# EAGLE design bGeigie3 (EAGLE 6.5.0)
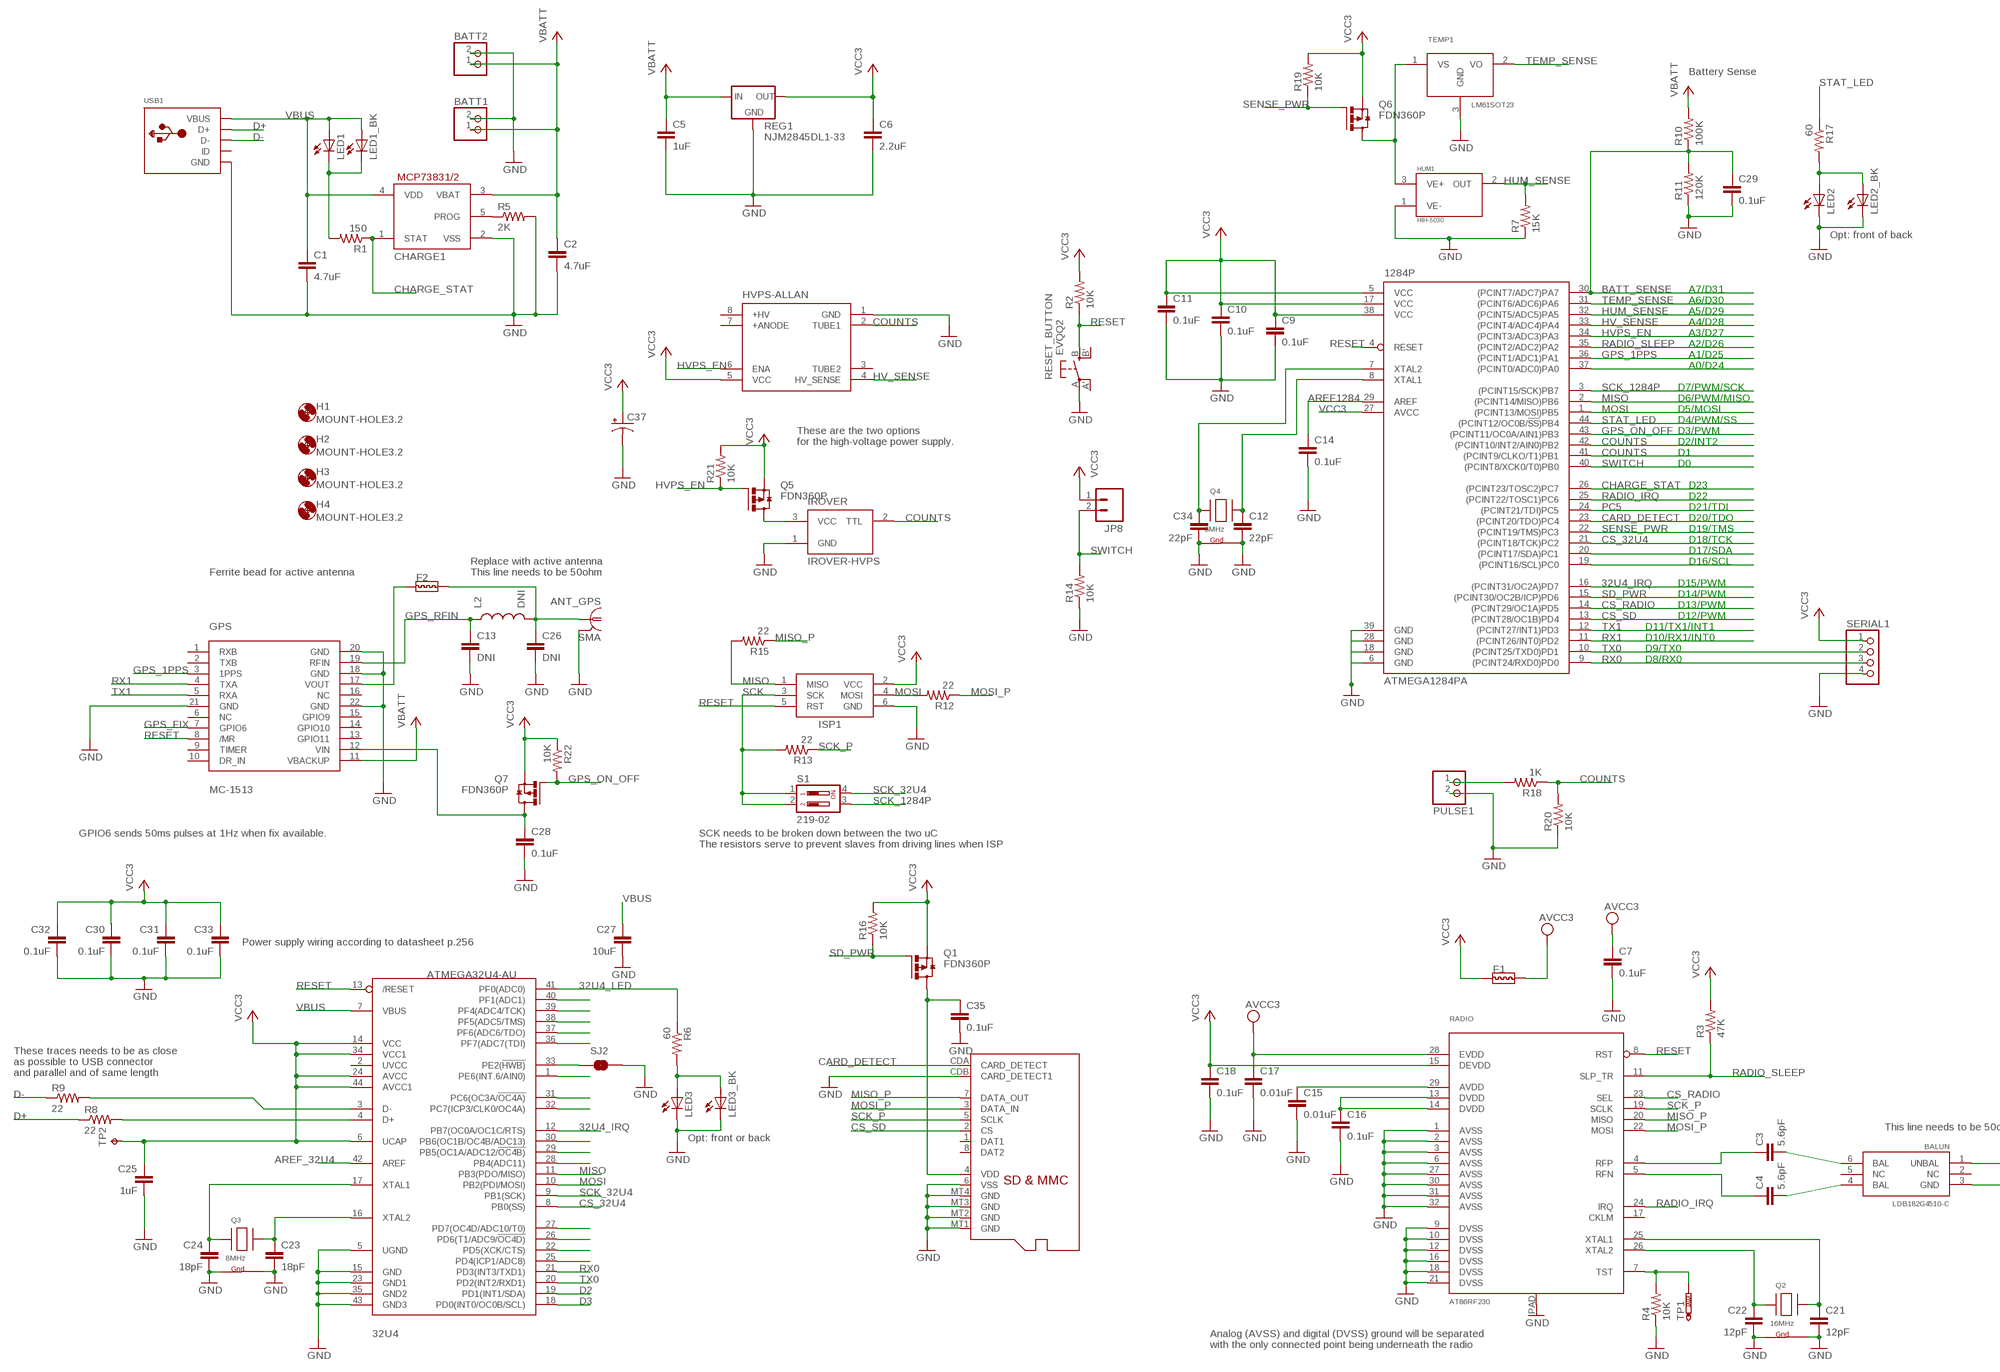
[diagram p0: schematic, sheet 1, part 1 of 2]
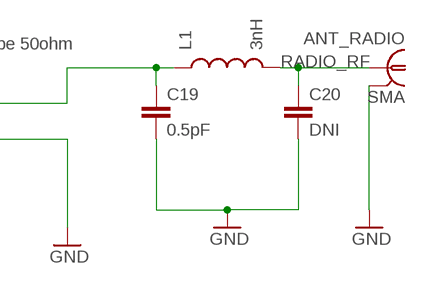
[diagram p1: schematic, sheet 1, part 2 of 2]

## Parts
32U4  ATMEGA32U4-AU  [TQFP44]
1284P  ATMEGA1284PA  [TQFP44]
ANT_GPS  SMA  LTI-SASF54GT  [LTI-SASF54GT]
ANT_RADIO  SMA  LTI-SASF54GT  [LTI-SASF54GT]
BALUN  LDB182G4510-C  [LDB182G4510-C]
BATT1  JST_2PIN-THM  [JST-PH-2-THM]
BATT2  JST_2PIN-THM  [JST-PH-2-THM]
C1  4.7uF  CAP0805  [0805]
C2  4.7uF  CAP0805  [0805]
C3  5.6pF  CAP0402-CAP  [0402-CAP]
C4  5.6pF  CAP0402-CAP  [0402-CAP]
C5  1uF  CAP0805  [0805]
C6  2.2uF  CAP0805  [0805]
C7  0.1uF  CAP0603-CAP  [0603-CAP]
C9  0.1uF  CAP0603-CAP  [0603-CAP]
C10  0.1uF  CAP0603-CAP  [0603-CAP]
C11  0.1uF  CAP0603-CAP  [0603-CAP]
C12  22pF  CAP0603-CAP  [0603-CAP]
C13  DNI  CAP0402-CAP  [0402-CAP]
C14  0.1uF  CAP0603-CAP  [0603-CAP]
C15  0.01uF  CAP0603-CAP  [0603-CAP]
C16  0.1uF  CAP0603-CAP  [0603-CAP]
C17  0.01uF  CAP0603-CAP  [0603-CAP]
C18  0.1uF  CAP0603-CAP  [0603-CAP]
C19  0.5pF  CAP0402-CAP  [0402-CAP]
C20  DNI  CAP0402-CAP  [0402-CAP]
C21  12pF  CAP0603-CAP  [0603-CAP]
C22  12pF  CAP0603-CAP  [0603-CAP]
C23  18pF  CAP0603-CAP  [0603-CAP]
C24  18pF  CAP0603-CAP  [0603-CAP]
C25  1uF  CAP0603-CAP  [0603-CAP]
C26  DNI  CAP0402-CAP  [0402-CAP]
C27  10uF  CAP0805  [0805]
C28  0.1uF  CAP0603-CAP  [0603-CAP]
C29  0.1uF  CAP0603-CAP  [0603-CAP]
C30  0.1uF  CAP0603-CAP  [0603-CAP]
C31  0.1uF  CAP0603-CAP  [0603-CAP]
C32  0.1uF  CAP0603-CAP  [0603-CAP]
C33  0.1uF  CAP0603-CAP  [0603-CAP]
C34  22pF  CAP0603-CAP  [0603-CAP]
C35  0.1uF  CAP0603-CAP  [0603-CAP]
C37  CPOL-USD/7343-31W  [D/7343-31W]
CHARGE1  MCP73831/OT  [SOT23-5L]
F1  L-FERRITE-BEAD-0805  [0805]
F2  L-FERRITE-BEAD-0805  [0805]
GPS  MC-1513  [S4-1513]
H1  MOUNT-HOLE3.2  [3,2]
H2  MOUNT-HOLE3.2  [3,2]
H3  MOUNT-HOLE3.2  [3,2]
H4  MOUNT-HOLE3.2  [3,2]
HUM1  HIH-5030  [HIH-5030]
HVPS-ALLAN  HVPS-ALLANV2-REVERSE  [HVPS-ALLAN-V2-REVERSE]
IROVER  IROVER-HVPS  [IROVER]
ISP1  AVRISP-6  [AVRISP]
JP8  M023.5MM  [SCREWTERMINAL-3.5MM-2]
L1  3nH  INDUCTOR0402  [C0402]
L2  DNI  INDUCTOR0402  [C0402]
LED1  LEDCHIPLED_0603  [CHIPLED_0603]
LED1_BK  LEDCHIPLED_0603  [CHIPLED_0603]
LED2  LEDCHIPLED_0603  [CHIPLED_0603]
LED2_BK  LEDCHIPLED_0603  [CHIPLED_0603]
LED3  LEDCHIPLED_0603  [CHIPLED_0603]
LED3_BK  LEDCHIPLED_0603  [CHIPLED_0603]
PULSE1  JST_2PIN-THM  [JST-PH-2-THM]
Q1  FDN360P  [SUPER-SOT3]
Q2  16MHz  XTAL-4-3225  [NX3225]
Q3  8MHz  XTAL-4  [CRYSTAL-5032]
Q4  8MHz  XTAL-4  [CRYSTAL-5032]
Q5  FDN360P  [SUPER-SOT3]
Q6  FDN360P  [SUPER-SOT3]
Q7  FDN360P  [SUPER-SOT3]
R1  150  R-US_R0805  [R0805]
R2  10K  R-US_R0603  [R0603]
R3  47K  R-US_R0603  [R0603]
R4  10K  R-US_R0603  [R0603]
R5  2K  R-US_R0603  [R0603]
R6  60  R-US_R0805  [R0805]
R7  15K  R-US_R0603  [R0603]
R8  22  R-US_R0603  [R0603]
R9  22  R-US_R0603  [R0603]
R10  100K  R-US_R0603  [R0603]
R11  120K  R-US_R0603  [R0603]
R12  22  R-US_R0603  [R0603]
R13  22  R-US_R0603  [R0603]
R14  10K  R-US_R0603  [R0603]
R15  22  R-US_R0603  [R0603]
R16  10K  R-US_R0603  [R0603]
R17  60  R-US_R0805  [R0805]
R18  1K  R-US_R0603  [R0603]
R19  10K  R-US_R0603  [R0603]
R20  10K  R-US_R0603  [R0603]
R21  10K  R-US_R0603  [R0603]
R22  10K  R-US_R0603  [R0603]
RADIO  AT86RF230  [32QN1]
REG1  NJM2845DL1-33  LP2950CDT-3.3  [DPACK]
RESET_BUTTON  EVQQ2  [EVQ-Q2]
S1  219-02  [CTS-219-02]
SD  MICROSD  [DM3AT-SF-PEJM5]
SERIAL1  PINHD-1X4  [1X04]
SJ2  SOLDERJUMPERTRACE  [SJ_2S-TRACE]
TEMP1  LM61SOT23  [SOT23]
TP1  PTR1B1,27  [B1,27]
TP2  TPTP15SQ  [TP15SQ]
USB1  USBMINIB  [USB-MINIB]

## Nets
32U4_IRQ: 32U4.12(PB7(OC0A/OC1C/RTS)) 1284P.16((PCINT31/OC2A)PD7)
32U4_LED: 32U4.41(PF0(ADC0)) R6.1
32U4_PC7: 32U4.32(PC7(ICP3/CLK0/OC4A))
AREF1284: 1284P.29(AREF) C14.1
AREF_32U4: 32U4.42(AREF)
AVCC3: C7.1 C17.1 F1.2 RADIO.28(EVDD)
BATT_SENSE: 1284P.30((PCINT7/ADC7)PA7) C29.1 R10.1 R11.2
CARD_DETECT: 1284P.23((PCINT20/TDO)PC4) SD.CDA(CARD_DETECT)
CHARGE_STAT: 1284P.26((PCINT23/TOSC2)PC7) CHARGE1.1(STAT) R1.1
COUNTS: 1284P.41((PCINT9/CLKO/T1)PB1) 1284P.42((PCINT10/INT2/AIN0)PB2) HVPS-ALLAN.2(TUBE1) IROVER.2(TTL) R18.1 R20.2
CS_32U4: 32U4.8(PB0(SS)) 1284P.21((PCINT18/TCK)PC2)
CS_RADIO: 1284P.14((PCINT29/OC1A)PD5) RADIO.23(SEL)
CS_SD: 1284P.13((PCINT28/OC1B)PD4) SD.2(CS)
D2: 32U4.19(PD1(INT1/SDA))
D3: 32U4.18(PD0(INT0/OC0B/SCL))
D+: R8.1 USB1.D+
D-: R9.1 USB1.D-
GND: 32U4.5(UGND) 32U4.15(GND) 32U4.23(GND1) 32U4.35(GND2) 32U4.43(GND3) 1284P.6(GND) 1284P.18(GND) 1284P.28(GND) 1284P.39(GND) ANT_GPS.2(GND) ANT_RADIO.2(GND) BALUN.3(GND) BATT1.2 BATT2.2 C1.2 C2.2 C5.2 C6.2 C7.2 C9.2 C10.2 C11.2 C12.2 C13.2 C14.2 C15.2 C16.2 C17.2 C18.2 C19.2 C20.2 C21.2 C22.2 C23.2 C24.2 C25.2 C26.2 C27.2 C28.2 C29.2 C30.2 C31.2 C32.2 C33.2 C34.2 C35.2 C37.- CHARGE1.2(VSS) GPS.18(GND) GPS.20(GND) GPS.21(GND) GPS.22(GND) HUM1.1(VE-) HVPS-ALLAN.1(GND) IROVER.1(GND) ISP1.6(GND) LED2.C LED2_BK.C LED3.C LED3_BK.C PULSE1.2 Q2.2(G2) Q2.4(G1) Q3.2(G1) Q3.4(G2) Q4.2(G1) Q4.4(G2) R4.1 R5.2 R7.1 R11.1 R14.1 R20.1 RADIO.1(AVSS) RADIO.2(AVSS) RADIO.3(AVSS) RADIO.6(AVSS) RADIO.9(DVSS) RADIO.10(DVSS) RADIO.12(DVSS) RADIO.16(DVSS) RADIO.18(DVSS) RADIO.21(DVSS) RADIO.27(AVSS) RADIO.30(AVSS) RADIO.31(AVSS) RADIO.32(AVSS) RADIO.PAD REG1.4(GND) RESET_BUTTON.A(P) SD.6(VSS) SD.CDB(CARD_DETECT1) SD.MT1(GND) SD.MT2(GND) SD.MT3(GND) SD.MT4(GND) SERIAL1.4 SJ2.2 TEMP1.3(GND) USB1.GND
GPS_1PPS: 1284P.36((PCINT1/ADC1)PA1) GPS.3(1PPS)
GPS_FIX: GPS.7(GPIO6)
GPS_ON_OFF: 1284P.43((PCINT11/OC0A/AIN1)PB3) Q7.1(G) R22.2
GPS_RFIN: C13.1 GPS.19(RFIN) L2.1
HUM_SENSE: 1284P.32((PCINT5/ADC5)PA5) HUM1.2(OUT) R7.2
HV_SENSE: 1284P.33((PCINT4/ADC4)PA4) HVPS-ALLAN.4(HV_SENSE)
HVPS_EN: 1284P.34((PCINT3/ADC3)PA3) HVPS-ALLAN.6(ENA) Q5.1(G) R21.1
MISO: 32U4.11(PB3(PDO/MISO)) 1284P.2((PCINT14/MISO)PB6) ISP1.1(MISO) R15.2
MISO_P: R15.1 RADIO.20(MISO) SD.7(DATA_OUT)
MOSI: 32U4.10(PB2(PDI/MOSI)) 1284P.1((PCINT13/MOSI)PB5) ISP1.4(MOSI) R12.2
MOSI_P: R12.1 RADIO.22(MOSI) SD.3(DATA_IN)
N$1: 32U4.16(XTAL2) C23.1 Q3.3(X2)
N$2: LED1.C LED1_BK.C R1.2
N$3: PULSE1.1 R18.2
N$4: CHARGE1.5(PROG) R5.1
N$5: BALUN.4(BAL) C4.2
N$6: 1284P.8(XTAL1) C12.1 Q4.3(X2)
N$7: 1284P.7(XTAL2) C34.1 Q4.1(X1)
N$8: C16.1 RADIO.13(DVDD) RADIO.14(DVDD)
N$9: C15.1 RADIO.29(AVDD)
N$11: ANT_GPS.1 C26.1 F2.2 L2.2
N$12: C21.1 Q2.3(X2) RADIO.25(XTAL1)
N$13: C22.1 Q2.1(X1) RADIO.26(XTAL2)
N$14: F2.1 GPS.17(VOUT)
N$15: IROVER.3(VCC) Q5.3(D)
N$16: LED3.A LED3_BK.A R6.2
N$17: R4.2 RADIO.7(TST) TP1.TP
N$18: BALUN.6(BAL) C3.2
N$19: C4.1 RADIO.5(RFN)
N$20: C3.1 RADIO.4(RFP)
N$21: BALUN.1(UNBAL) C19.1 L1.1
N$22: C28.1 GPS.12(VIN) Q7.3(D)
N$24: 32U4.17(XTAL1) C24.1 Q3.1(X1)
N$25: LED2.A LED2_BK.A R17.2
N$26: 32U4.40(PF1(ADC1))
N$27: 32U4.3(D-) R9.2
N$28: 32U4.4(D+) R8.2
N$29: 32U4.39(PF4(ADC4/TCK))
N$30: 32U4.38(PF5(ADC5/TMS))
N$31: 32U4.37(PF6(ADC6/TDO))
N$32: 32U4.33(PE2(!HWB)) SJ2.1
N$33: 32U4.36(PF7(ADC7(TDI))
N$34: 32U4.1(PE6(INT.6/AIN0))
N$35: 32U4.31(PC6(OC3A/!OC4A))
N$36: 32U4.30(PB6(OC1B/OC4B/ADC13))
N$37: 32U4.29(PB5(OC1A/ADC12/!OC4B))
N$38: 32U4.28(PB4(ADC11))
N$39: 32U4.27(PD7(OC4D/ADC10/T0))
N$41: 32U4.26(PD6(T1/ADC9/!OC4D))
N$42: 32U4.22(PD5(XCK/CTS))
N$43: 32U4.25(PD4(ICP1/ADC8))
PA0: 1284P.37((PCINT0/ADC0)PA0)
PC0: 1284P.19((PCINT16/SCL)PC0)
PC1: 1284P.20((PCINT17/SDA)PC1)
PC5: 1284P.24((PCINT21/TDI)PC5)
RADIO_IRQ: 1284P.25((PCINT22/TOSC1)PC6) RADIO.24(IRQ)
RADIO_RF: ANT_RADIO.1 C20.1 L1.2
RADIO_SLEEP: 1284P.35((PCINT2/ADC2)PA2) R3.1 RADIO.11(SLP_TR)
RESET: 32U4.13(/RESET) 1284P.4(RESET) GPS.8(/MR) ISP1.5(RST) R2.1 RADIO.8(RST) RESET_BUTTON.B(S)
RX0: 32U4.21(PD3(INT3/TXD1)) 1284P.9((PCINT24/RXD0)PD0) SERIAL1.3
RX1: 1284P.11((PCINT26/INT0)PD2) GPS.4(TXA)
SCK: ISP1.3(SCK) R13.2 S1.1 S1.2
SCK_32U4: 32U4.9(PB1(SCK)) S1.4
SCK_1284P: 1284P.3((PCINT15/SCK)PB7) S1.3
SCK_P: R13.1 RADIO.19(SCLK) SD.5(SCLK)
SD_PWR: 1284P.15((PCINT30/OC2B/ICP)PD6) Q1.1(G) R16.1
SENSE: HUM1.3(VE+) Q6.3(D) TEMP1.1(VS)
SENSE_PWR: 1284P.22((PCINT19/TMS)PC3) Q6.1(G) R19.1
STAT_LED: 1284P.44((PCINT12/OC0B/!SS!)PB4) R17.1
SWITCH: 1284P.40((PCINT8/XCK0/T0)PB0) JP8.2 R14.2
TEMP_SENSE: 1284P.31((PCINT6/ADC6)PA6) TEMP1.2(VO)
TX0: 32U4.20(PD2(INT2/RXD1)) 1284P.10((PCINT25/TXD0)PD1) SERIAL1.2
TX1: 1284P.12((PCINT27/INT1)PD3) GPS.5(RXA)
VBATT: BATT1.1 BATT2.1 C2.1 C5.1 CHARGE1.3(VBAT) GPS.11(VBACKUP) R10.2 REG1.1(IN)
VBUS: 32U4.7(VBUS) C1.1 C27.1 CHARGE1.4(VDD) LED1.A LED1_BK.A USB1.VBUS
VCC3: 32U4.6(UCAP) 32U4.14(VCC) 32U4.24(AVCC) 32U4.34(VCC1) 32U4.44(AVCC1) 1284P.5(VCC) 1284P.17(VCC) 1284P.27(AVCC) 1284P.38(VCC) C6.1 C9.1 C10.1 C11.1 C18.1 C25.1 C30.1 C31.1 C32.1 C33.1 C37.+ F1.1 HVPS-ALLAN.5(VCC) ISP1.2(VCC) JP8.1 Q1.2(S) Q5.2(S) Q6.2(S) Q7.2(S) R2.2 R3.2 R16.2 R19.2 R21.2 R22.1 RADIO.15(DEVDD) REG1.3(OUT) SERIAL1.1 TP2.TP
VDD: C35.1 Q1.3(D) SD.4(VDD)
Unconnected: 32U4.2(UVCC) BALUN.2(NC) BALUN.5(NC) GPS.1(RXB) GPS.2(TXB) GPS.6(NC) GPS.9(TIMER) GPS.10(DR_IN) GPS.13(GPIO11) GPS.14(GPIO10) GPS.15(GPIO9) GPS.16(NC) HVPS-ALLAN.3(TUBE2) HVPS-ALLAN.7(+ANODE) HVPS-ALLAN.8(+HV) RADIO.17(CKLM) RESET_BUTTON.A'(P1) RESET_BUTTON.B'(S1) SD.1(DAT1) SD.8(DAT2) USB1.ID

## Notes on the sheet
- Battery Sense
- Opt: front of back
- A7/D31
- A6/D30
- A5/D29
- A4/D28
- A3/D27
- A2/D26
- A1/D25
- A0/D24
- D7/PWM/SCK
- D6/PWM/MISO
- D5/MOSI
- D4/PWM/SS
- These are the two options | D3/PWM
- for the high-voltage power supply. | D2/INT2
- D1
- D0
- D23
- D22
- D21/TDI
- D20/TDO
- D19/TMS
- D18/TCK
- D17/SDA
- Replace with active antenna | D16/SCL
- Ferrite bead for active antenna | This line needs to be 50ohm
- D15/PWM
- D14/PWM
- D13/PWM
- D12/PWM
- D11/TX1/INT1
- D10/RX1/INT0
- D9/TX0
- D8/RX0
- GPIO6 sends 50ms pulses at 1Hz when fix available. | SCK needs to be broken down between the two uC
- The resistors serve to prevent slaves from driving lines when ISP
- Power supply wiring according to datasheet p.256
- These traces needs to be as close
- as possible to USB connector
- and parallel and of same length
- This line needs to be 50ohm
- Opt: front or back
- Analog (AVSS) and digital (DVSS) ground will be separated
- with the only connected point being underneath the radio

## Power pins joined to a net without a drawn wire
GND: ANT_GPS.3(GND) ANT_GPS.4(GND) ANT_GPS.5(GND) ANT_RADIO.3(GND) ANT_RADIO.4(GND) ANT_RADIO.5(GND)

## Library data of the parts
32U4 = adafruit:ATMEGA32U4: http://www.ladyada.net/library/eagle
1284P = Robin:ATMEGA1284P: 8-bit Microcontroller with 128K Bytes In-System Programmable Flash Source: http://www.atmel.com/dyn/resources/prod_documents/doc8059.pdf; MPN: ATMEGA644PV-10AU; OC_FARNELL: 1455123; OC_NEWARK: 58M3748
ANT_GPS ANT_RADIO = con-coax:LTI-SASF54GT: SMA vertical PCB thrue hole jack Source: Lighthorse Technologies, inc. SASF54GT.pdf; OC_FARNELL: unknown; OC_NEWARK: unknown
BALUN = Robin:LDB182G4510-C
BATT1 BATT2 PULSE1 = adafruit:JST_2PIN: JST 2-Pin Connectors of various flavors SMT-RA (S2B-PH-SM4) 4UConnector #17311 SMT (B2B-PH-SM4) THM-RA (S2B-PH) THM (B2B-PH)
C1-C7 C9-C35 = SparkFun:CAP: Capacitor Standard 0603 ceramic capacitor, and 0.1" leaded capacitor.
C37 = Robin:CPOL-US: POLARIZED CAPACITOR, American symbol
CHARGE1 = adafruit:MCP73831: MCP73831/2 Miniature Single-Cell, Fully Integrated Li-Ion, Li-Polymer Charge Management Controllers. Nice and small simple lipoly charge controller, with adjustable current and status output (LED) http://www.ladyada.net/library/pcb/eaglelibrary.html
F1 F2 = Discreter:L-FERRITE-BEAD
GPS = Robin:MC-1513: Low power GPS receiver IC from Locsys
H1-H4 = holes:MOUNT-HOLE: MOUNTING HOLE with drill center marker
HUM1 = Robin:HIH-5030
HVPS-ALLAN = Robin:HVPS-ALLAN
IROVER = Robin:IROVER-HVPS
ISP1 = adafruit:AVRISP: AVR ISP HEADER Standard 6 pin header for AVR programming
JP8 = SparkFun:M02: Header 2 Standard 2-pin 0.1" header. Use with straight break away headers (SKU : PRT-00116), right angle break away headers (PRT-00553), swiss pins (PRT-00743), machine pins (PRT-00117), and female headers (PRT-00115). Molex polarized connector foot print use with SKU : PRT-08233 with associated crimp pins and housings.
L1 L2 = SparkFun:INDUCTOR: Inductors Basic Inductor/Choke - 0603 and 1206. Footprints are not proven and vary greatly between part numbers.
LED1 LED1_BK LED2 LED2_BK LED3 LED3_BK = adafruit:LED: LED OSRAM: - CHIPLED LG R971, LG N971, LY N971, LG Q971, LY Q971, LO R971, LY R971 LH N974, LH R974 LS Q976, LO Q976, LY Q976 LO Q996 - Hyper CHIPLED LW Q18S LB Q993, LB Q99A, LB R99A - SideLED LS A670, LO A670, LY A670, LG A670, LP A670 LB A673, LV A673, LT A673, LW A673 LH A674 LY A675 LS A676, LA A676, LO A676, LY A676, LW A676 LS A679, LY A679, LG A679 - Hyper Micro SIDELED® LS Y876, LA Y876, LO Y876, LY Y876 LT Y87S - SmartLED LW L88C, LW L88S LB L89C, LB L89S, LG L890 LS L89K, LO L89K, LY L89K LS L896, LA L896, LO L896, LY L896 - TOPLED LS T670, LO T670, LY T670, LG T670, LP T670 LSG T670, LSP T670, LSY T670, LOP T670, LYG T670 LG T671, LOG T671, LSG T671 LB T673, LV T673, LT T673, LW T673 LH T674 LS T676, LA T676, LO T676, LY T676, LB T676, LH T676, LSB T676, LW T676 LB T67C, LV T67C, LT T67C, LS T67K, LO T67K, LY T67K, LW E67C LS E67B, LA E67B, LO E67B, LY E67B, LB E67C, LV E67C, LT E67C LW T67C LS T679, LY T679, LG T679 LS T770, LO T770, LY T770, LG T770, LP T770 LB T773, LV T773, LT T773, LW T773 LH T774 LS E675, LA E675, LY E675, LS T675 LS T776, LA T776, LO T776, LY T776, LB T776 LHGB T686 LT T68C, LB T68C - Hyper Mini TOPLED® LB M676 - Mini TOPLED Santana® LG M470 LS M47K, LO M47K, LY M47K Source: http://www.osram.convergy.de/
Q1 Q5-Q7 = transistor-power:FDN360P: Single P-Channel, PowerTrench (R) MOSFET Source: http://www.fairchildsemi.com/ds/FD/FDN360P.pdf
Q2 = adafruit:XTAL-4: Classic 4-pin 3.2 x 2.5mm crystal
Q3 Q4 = Robin:XTAL-4
R1-R22 = adafruit:R-US_: RESISTOR, American symbol
RADIO = Robin:AT86RF230
REG1 = v-reg:LP2950?*: Source: http://cache.national.com/ds/LP/LP2950.pdf
RESET_BUTTON = adafruit:EVQQ2: SMT 6mm switch, EVQQ2 series http://www.ladyada.net/library/eagle
S1 = switch-dil:219-02*: Surface Mount DIP Switch Series 219 SMT CTS Electronic Components Sourc: www.ctscorp.com; OC_FARNELL: unknown; OC_NEWARK: unknown
SD = Robin:MICROSD: Micro-SD / Transflash card holder with SPI pinout For the 3M # 2908-05WB-MG and/or 4UCON #19656 push-push type
SERIAL1 = pinhead:PINHD-1X4: PIN HEADER
SJ2 = SparkFun:SOLDERJUMPER: Solder Jumper Standard SMD solder jumper. Used to automate production. Two varients : Normally Open and Normally Closed are the same, but have different paste layers. NC will have a large amount of paste and should jumper during reflow.
TEMP1 = Robin:LM61: The LM61 is a precision integrated-circuit temperature sensor that can sense a ?30°C to +100°C temperature range while operating from a single +2.7V supply. The LM61's output volt- age is linearly proportional to Celsius (Centigrade) tempera- ture (+10 mV/°C) and has a DC offset of +600 mV. The offset allows reading negative temperatures without the need for a negative supply. The nominal output voltage of the LM61 ranges from +300 mV to +1600 mV for a ?30°C to +100°C temperature range. The LM61 is calibrated to provide accu- racies of ±2.0°C at room temperature and ±3°C over the full ?25°C to +85°C temperature range.
TP1 = testpad:PTR1: TEST PIN
TP2 = testpad:TP: Test pad
USB1 = adafruit:USB: USB Connectors USBMINIB - Surface Mount Female Mini-B USB Connector 4UConnector: 06564 By microbuilder.eu Thru-hole RA Female Mini-B USB Connector 4UConnector: 18732 By ladyada.net

## Board
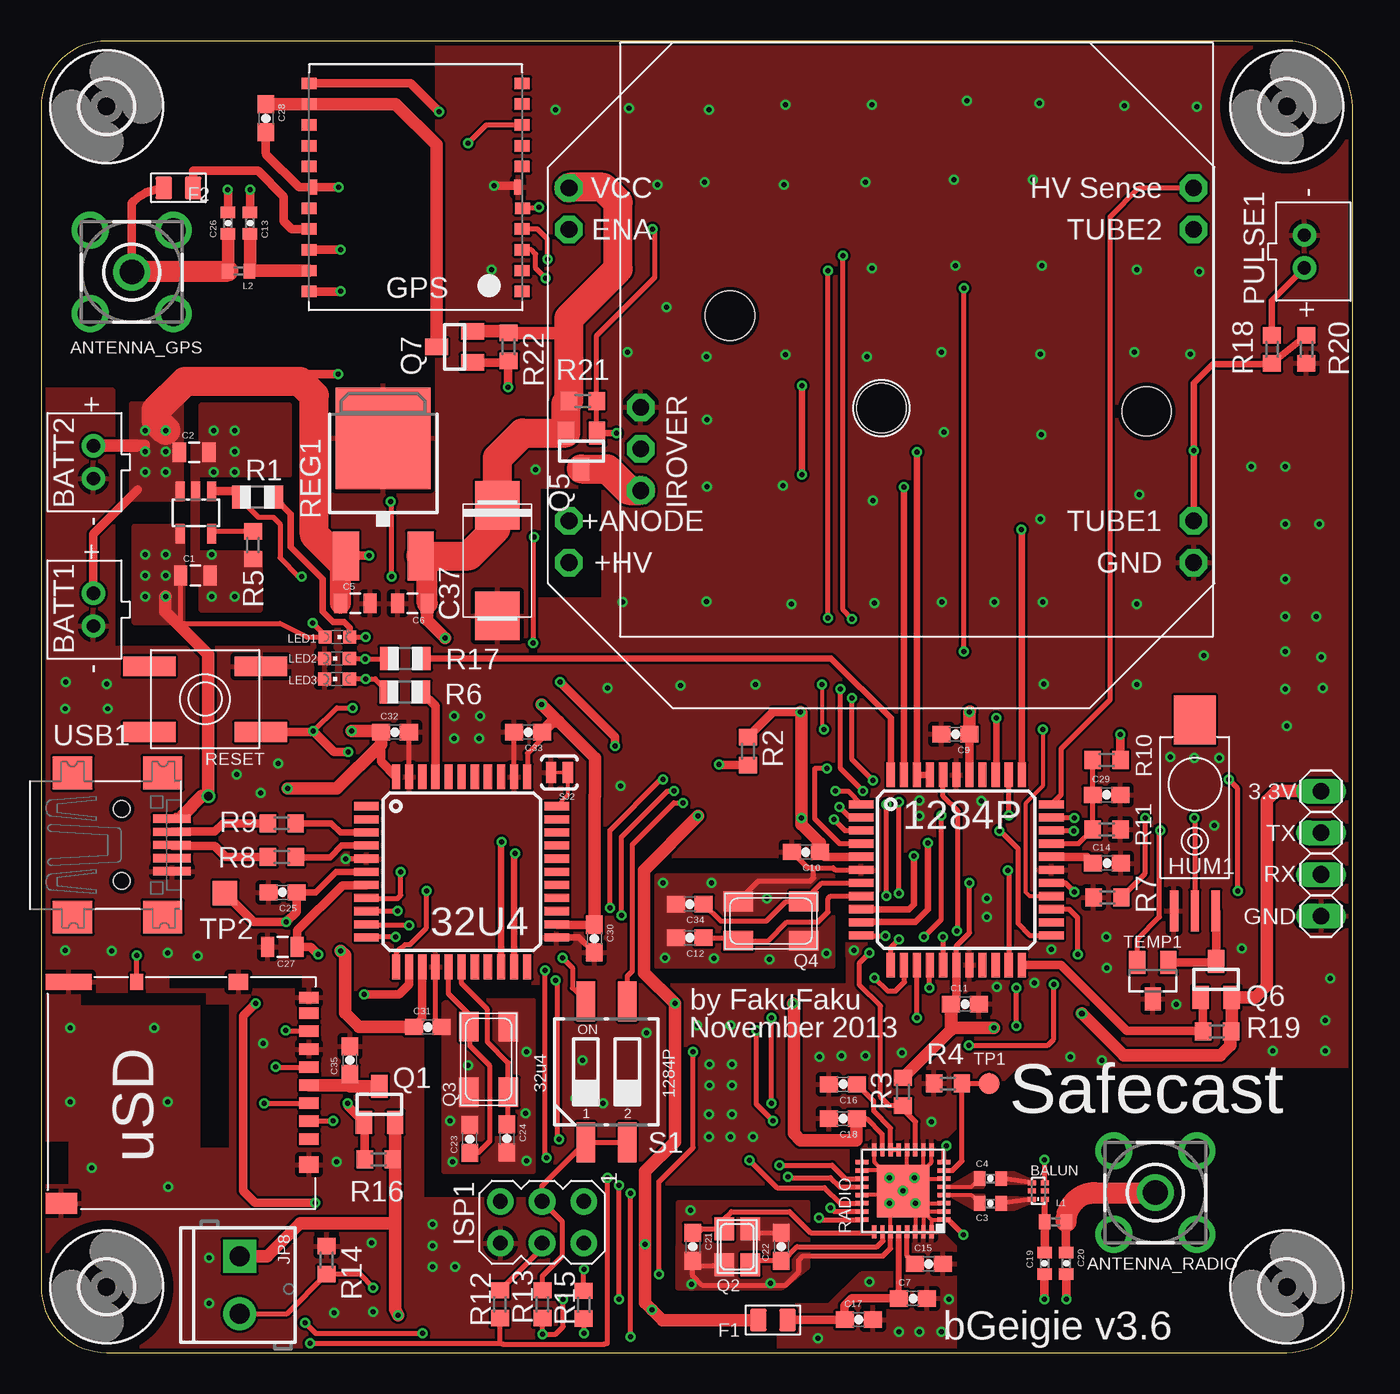
[diagram p2: board, top side]
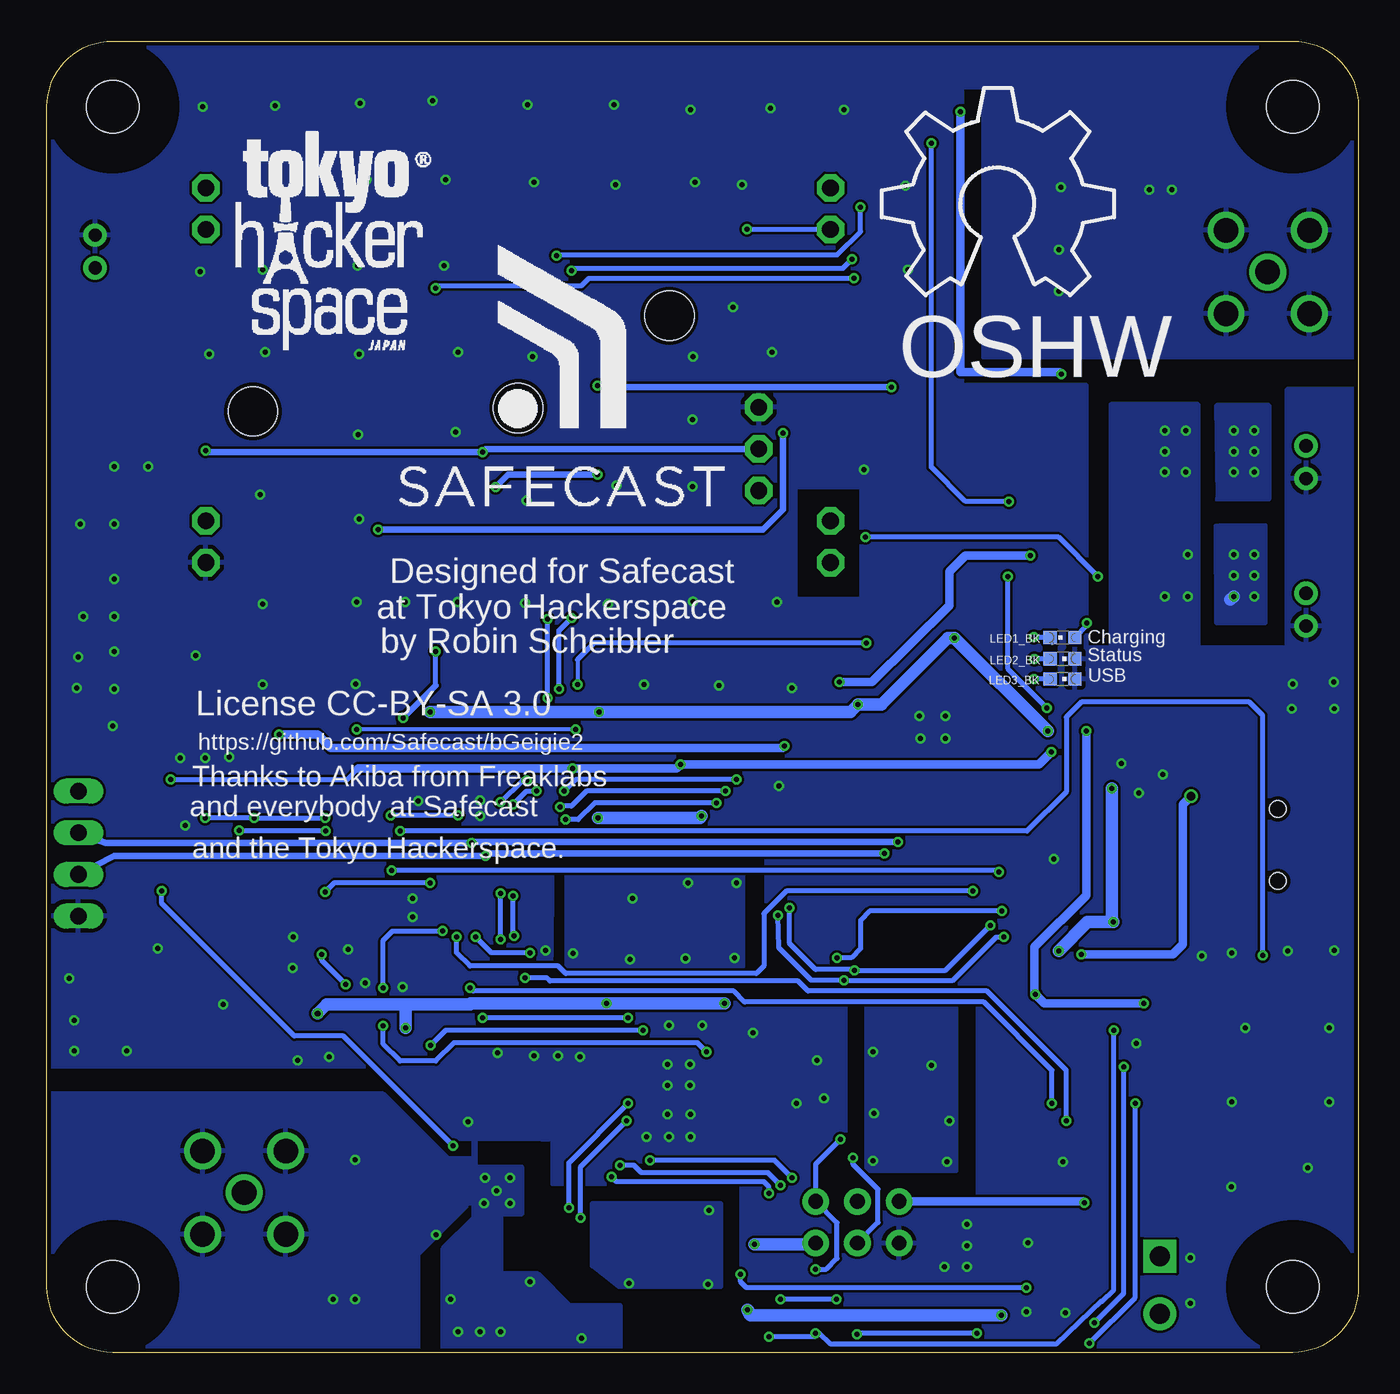
[diagram p3: board, bottom side, seen from below]

Size 80 x 80 mm. Coordinates in mm from the lower left corner, seen from the top.
Outline: 4,80 arc90 0,76 0,4 arc90 4,0 76,0 arc90 80,4 80,76 arc90 76,80 4,80
Copper layers (1*16): Top 0.035mm / dielectric 1.5mm / Bottom 0.035mm
Design rules "Fusion_eagle_rule_v1.1": minimum track width 6mil, minimum drill 12mil, track to track 6mil, track to pad 6mil, pad to pad 6mil, via to via 6mil, smd to smd 0mil, copper to edge 10mil, drill to drill 10mil, minimum pad ring 10mil, minimum via ring 6mil, stop-mask expansion 2mil, vias tented up to drill 100mil, thermal gap 10mil

### Footprints (pad centres in the part's own frame; a part is rotated, then mirrored left to right if it is on the bottom)
TQFP44 = smd 1.5 x 0.5: 1 -5.8,4; 2 -5.8,3.2; 3 -5.8,2.4; 4 -5.8,1.6; 5 -5.8,0.8; 6 -5.8,0; 7 -5.8,-0.8; 8 -5.8,-1.6; 9 -5.8,-2.4; 10 -5.8,-3.2; 11 -5.8,-4; 23 5.8,-4; 24 5.8,-3.2; 25 5.8,-2.4; 26 5.8,-1.6; 27 5.8,-0.8; 28 5.8,0; 29 5.8,0.8; 30 5.8,1.6; 31 5.8,2.4; 32 5.8,3.2; 33 5.8,4 | smd 0.5 x 1.5: 12 -4,-5.8; 13 -3.2,-5.8; 14 -2.4,-5.8; 15 -1.6,-5.8; 16 -0.8,-5.8; 17 0,-5.8; 18 0.8,-5.8; 19 1.6,-5.8; 20 2.4,-5.8; 21 3.2,-5.8; 22 4,-5.8; 34 4,5.8; 35 3.2,5.8; 36 2.4,5.8; 37 1.6,5.8; 38 0.8,5.8; 39 0,5.8; 40 -0.8,5.8; 41 -1.6,5.8; 42 -2.4,5.8; 43 -3.2,5.8; 44 -4,5.8
LTI-SASF54GT = drill 1.5 pad 2.2: 1 0,0; 2 -2.54,2.54; 3 2.54,2.54; 4 2.54,-2.54; 5 -2.54,-2.54
LDB182G4510-C = smd 0.3 x 0.5: 1 0.5,0.4; 2 0,0.4; 3 -0.5,0.4; 4 -0.5,-0.4; 5 0,-0.4; 6 0.5,-0.4
JST-PH-2-THM = drill 0.8 pad 1.422: 1 1,0; 2 -1,0
0805 = smd 0.8 x 1.2: 1 -0.9,0; 2 0.9,0
0402-CAP = smd 0.7 x 0.9: 1 -0.65,0; 2 0.65,0
0603-CAP = smd 1.1 x 1: 1 -0.85,0; 2 0.85,0
D/7343-31W = smd 2.95 x 2.7: + 3.375,0; - -3.375,0
SOT23-5L = smd 0.55 x 1.2: 1 -0.95,-1.3; 2 0,-1.3; 3 0.95,-1.3; 4 0.95,1.3; 5 -0.95,1.3
0805' = smd 1.016 x 1.397: 1 -0.889,0; 2 0.889,0
S4-1513 = smd 0.92 x 0.7: 1 -6.5,6.35; 2 -6.5,5.08; 3 -6.5,3.81; 4 -6.5,2.54; 5 -6.53,1.27; 6 -6.5,-1.27; 7 -6.5,-2.54; 8 -6.5,-3.81; 9 -6.5,-5.08; 10 -6.5,-6.35; 11 6.5,-6.35; 12 6.5,-5.08; 13 6.5,-3.81; 14 6.5,-2.54; 15 6.5,-1.27; 16 6.5,1.27; 17 6.5,2.54; 18 6.5,3.81; 19 6.5,5.08; 20 6.5,6.35 | smd 0.5 x 0.92: 21 -6.25,0; 22 6.25,0
3,2 = hole 3.2: 0,0
HIH-5030 = smd 0.51 x 2.5: 1 -1.27,-1.25; 2 0,-1.25; 3 1.27,-1.25 | smd 2.54 x 3: 4 0,10.39
HVPS-ALLAN-V2-REVERSE = drill 1.016 pad 1.676 octagon: 1 1.27,-1.27; 2 1.27,-3.81; 3 1.27,-21.59; 4 1.27,-24.13; 5 39.37,-24.13; 6 39.37,-21.59; 7 39.37,-3.81; 8 39.37,-1.27 | hole 3: 20.32,-10.7
IROVER = drill 1.016 pad 1.676 octagon: 1 22.225,1.27; 2 24.765,1.27; 3 27.305,1.27 | hole 3: 22.479,32.131; 16.637,6.731
AVRISP = drill 0.9 pad 1.626: 1 -1.27,2.54; 2 1.27,2.54; 3 -1.27,0; 4 1.27,0; 5 -1.27,-2.54; 6 1.27,-2.54
SCREWTERMINAL-3.5MM-2 = drill 1.2 pad 2.032 square: 1 0,0 | drill 1.2 pad 2.032: 2 3.5,0
C0402 = smd 0.7 x 0.9: 1 -0.65,0; 2 0.65,0
CHIPLED_0603 = smd 0.8 x 0.8: A 0,-0.75; C 0,0.75
SUPER-SOT3 = smd 1 x 1.4: 1 -0.95,-1.1; 2 0.95,-1.1; 3 0,1.1
NX3225 = smd 1.4 x 1.2: 1 -1.1,-0.8; 2 1.1,-0.8; 3 1.1,0.8; 4 -1.1,0.8
CRYSTAL-5032 = smd 1.8 x 1.2: 1 -2,-1.2; 2 2,-1.2; 3 2,1.2; 4 -2,1.2
R0805 = smd 1.1 x 1.4: 1 -1,0; 2 1,0
R0603 = smd 1 x 1.1: 1 -0.85,0; 2 0.85,0
32QN1 = smd 0.8 x 0.27: 1 -2.5,1.75; 2 -2.5,1.25; 3 -2.5,0.75; 4 -2.5,0.25; 5 -2.5,-0.25; 6 -2.5,-0.75; 7 -2.5,-1.25; 8 -2.5,-1.75; 17 2.5,-1.75; 18 2.5,-1.25; 19 2.5,-0.75; 20 2.5,-0.25; 21 2.5,0.25; 22 2.5,0.75; 23 2.5,1.25; 24 2.5,1.75 | smd 0.27 x 0.8: 9 -1.75,-2.5; 10 -1.25,-2.5; 11 -0.75,-2.5; 12 -0.25,-2.5; 13 0.25,-2.5; 14 0.75,-2.5; 15 1.25,-2.5; 16 1.75,-2.5; 25 1.75,2.5; 26 1.25,2.5; 27 0.75,2.5; 28 0.25,2.5; 29 -0.25,2.5; 30 -0.75,2.5; 31 -1.25,2.5; 32 -1.75,2.5 | smd 3.2 x 3.2: PAD 0,0
DPACK = smd 1.6 x 3: 1 -2.28,-4.8; 3 2.28,-4.8 | smd 5.8 x 6.2: 4 0,2.38
EVQ-Q2 = smd 3.2 x 1.2: A -3.4,-2; A' 3.4,-2; B -3.4,2; B' 3.4,2
CTS-219-02 = smd 1.13 x 2.44: 1 -1.27,-4.3; 2 1.27,-4.3; 3 1.27,4.3; 4 -1.27,4.3
DM3AT-SF-PEJM5 = smd 0.7 x 1.2: 1 0,0.6; 2 -1.1,0.6; 3 -2.2,0.6; 4 -3.3,0.6; 5 -4.4,0.6; 6 -5.5,0.6; 7 -6.6,0.6; 8 -7.7,0.6; CDB -8.65,0.6 | smd 1 x 0.8: CDA -9.6,-9.9 | smd 1 x 1.2: MT1 -9.6,-3.7; MT4 1.55,0.6 | smd 1 x 2.8: MT2 -9.6,-14.05 | smd 1.3 x 1.9: MT3 3.9,-14.5
1X04 = drill 1.016 long: 1 -3.81,0; 2 -1.27,0; 3 1.27,0; 4 3.81,0
SJ_2S-TRACE = smd 0.635 x 1.27: 1 -0.508,0; 2 0.508,0
SOT23 = smd 1 x 1.4: 1 -0.95,-1.1; 2 0.95,-1.1; 3 0,1.1
B1,27 = smd 1.27 x 1.27: TP 0,0
TP15SQ = smd 1.5 x 1.5: TP 0,0
USB-MINIB = smd 0.5 x 2.308: D+ 0,4.064; D- -0.8,4.064; GND 1.6,4.064; ID 0.8,4.064; VBUS -1.6,4.064 | smd 2 x 2.4: GND1 -4.4,-2; GND2 -4.4,3.5; GND3 4.4,3.5; GND4 4.4,-2 | hole 1: -2.2,1; 2.2,1

### Placement (x,y rotation side)
32U4  25.66,29.32 0 top
1284P  55.83,29.44 0 top
ANT_GPS  5.54,65.91 180 top
ANT_RADIO  67.97,9.75 90 top
BALUN  60.83,9.86 270 top
BATT1  3.2,45.31 90 top
BATT2  3.2,54.31 90 top
C1  9.42,47.4 0 top
C2  9.35,54.91 0 top
C3  57.91,9.09 0 top
C4  57.91,10.62 0 top
C5  19.18,45.69 0 top
C6  22.66,45.69 180 top
C7  53.19,3.3 0 top
C9  55.78,37.72 180 top
C10  46.66,30.53 180 top
C11  56.36,21.26 0 top
C12  39.57,25.3 180 top
C13  12.75,68.88 90 top
C14  65.02,29.84 0 top
C15  54.15,5.41 0 top
C16  48.92,16.36 180 top
C17  49.89,2.01 0 top
C18  48.92,14.27 180 top
C19  61.21,5.44 270 top
C20  62.53,5.44 270 top
C21  39.75,6.45 270 top
C22  45.16,6.45 90 top
C23  26.16,13.03 90 top
C24  28.42,13.06 270 top
C25  14.73,28.07 180 top
C26  11.4,68.88 90 top
C27  14.73,24.74 180 top
C28  13.72,75.29 270 top
C29  65,34.01 0 top
C30  33.76,25.25 270 top
C31  23.6,19.86 0 top
C32  21.59,37.85 0 top
C33  29.72,37.85 180 top
C34  39.57,27.36 180 top
C35  18.85,17.83 90 top
C37  27.84,48.31 90 top
CHARGE1  9.45,51.23 180 top
F1  [0805']  44.65,1.98 0 top
F2  [0805']  8.38,71.04 180 top
GPS  22.84,71.07 180 top
H1  4,76 0 top
H2  76,4 0 top
H3  76,76 0 top
H4  4,4 0 top
HUM1  70.38,28.19 0 top
HVPS-ALLAN  71.58,46.91 180 top
IROVER  35.31,79.88 270 top
ISP1  30.56,7.95 270 top
JP8  12.12,5.87 270 top
L1  61.87,7.98 0 top
L2  12.06,65.96 180 top
LED1  18.08,43.64 270 top
LED1_BK  18.06,43.61 90 bottom
LED2  18.06,42.34 90 top
LED2_BK  18.06,42.32 270 bottom
LED3  18.06,41.07 90 top
LED3_BK  18.06,41.07 270 bottom
PULSE1  77.06,67.16 270 top
Q1  20.65,15.14 0 top
Q2  42.47,6.45 90 top
Q3  27.3,17.88 90 top
Q4  44.53,26.31 180 top
Q5  32.97,54.99 180 top
Q6  71.68,22.76 0 top
Q7  25.22,61.34 90 top
R1  13.21,52.17 0 top
R2  43.12,36.68 90 top
R3  52.58,15.9 90 top
R4  55.32,16.41 0 top
R5  12.93,49.25 270 top
R6  22.2,40.28 180 top
R7  65.05,27.76 0 top
R8  14.7,30.23 0 top
R9  14.68,32.29 0 top
R10  65,36.14 0 top
R11  65,31.9 180 top
R12  28,2.94 90 top
R13  30.59,2.94 90 top
R14  17.42,5.64 270 top
R15  33.1,2.92 90 top
R16  20.6,11.79 0 top
R17  22.23,42.34 180 top
R18  75.08,61.19 90 top
R19  71.73,19.58 0 top
R20  77.19,61.19 90 top
R21  33.05,58.04 180 top
R22  28.52,61.34 270 top
RADIO  52.58,9.86 180 top
REG1  20.88,53.39 0 top
RESET_BUTTON  10.01,39.85 180 top
S1  34.49,17.12 0 top
SD  15.75,13 270 top
SERIAL1  78.08,30.43 270 top
SJ2  31.62,35.38 180 top
TEMP1  67.82,22.68 180 top
TP1  57.84,16.41 90 top
TP2  11.23,28.02 0 top
U$1  [SAFECAST_LOGO]  59.05,50.37 0 bottom
U$3  [THS]  72.42,58.19 0 bottom
U$4  [OSHW_10X500_NOTEXT]  29.08,64.47 0 bottom
USB1  3.93,30.96 270 top

### Tracks (layer width: path | path; a pad name or v marks a point on that pad's centre or on a via)
32U4_IRQ  (via drill 0.3)
  Top 0.305: 1284P.16 55.03,25.34 v55.02,25.35 | v23.52,28.14 23.52,25.91 22.5,24.89 22.2,24.89 21.95,24.64 21.89,24.64 21.69,24.43 21.69,23.55 32U4.12
  Bottom 0.305: v23.52,28.14 34.9,28.14 36.27,26.77 36.27,23.57 36.73,23.11 48.36,23.11 48.82,23.57 54.2,23.57 55.02,24.38 v55.02,25.35
32U4_LED
  Top 0.508: 32U4.41 24.06,39.43 R6.1
AREF1284
  Top 0.508: C14.1 63.78,30.24 1284P.29
AVCC3
  Top 0.305: RADIO.28 | C7.1 52.33,3.31 | C17.1 49.02,2.02 | F1.2 45.57,2.01
  Top 0.356: 52.33,3.31 RADIO.28
  Top 0.508: C7.1 49.48,3.3 49.02,2.85 49.02,2.02 | 45.57,2.01 C17.1
BATT_SENSE
  Top 0.305: 1284P.30 63.28,31.04 R11.2 C29.1 R10.1
CARD_DETECT  (via drill 0.3)
  Top 0.305: SD.CDA v5.85,24.23 v5.84,24.23 | 1284P.23 61.62,25.45 60.3,25.45 59.59,26.16 59.59,30.73 58.52,31.8 v58.47,31.8
  Bottom 0.305: v5.84,24.23 5.84,38.86 6.66,39.67 16.92,39.67 17.83,38.76 17.83,34.19 20.22,31.8 v58.47,31.8
CHARGE_STAT  (via drill 0.3)
  Top 0.254: R1.1 12.21,52 | v47.65,40.74 47.65,38.1 v47.75,38 | v61.11,38 61.11,34.54 60.05,33.48 60.05,28.09 60.3,27.84 1284P.26
  Top 0.305: 30.07,43.33 v30.02,43.28 30.02,49.68 v30.07,49.73 | 12.21,52 13.26,50.95 14.17,50.95 14.58,50.55 14.58,48.46 15.7,47.35 v15.9,47.35
  Top 0.508: CHARGE1.1 11.85,52.53 R1.1
  Bottom 0.254: 47.65,42.27 v47.65,40.74 | v47.75,38 v61.11,38
  Bottom 0.305: v30.02,43.28 46.63,43.28 47.65,42.27 | v15.9,47.35 18.29,49.73 v30.07,49.73
COUNTS  (via drill 0.3)
  Top 0.406: 1284P.41 1284P.42 v53.43,54.93 | R20.2 R18.1 75.04,60.3 71.48,60.3 70.31,59.13 v70.31,55.02 HVPS-ALLAN.2
  Bottom 0.406: IROVER.2 53.24,55.12 v53.43,54.93 70.22,54.93 v70.31,55.02
CS_32U4  (via drill 0.3)
  Top 0.305: 1284P.21 59.03,29.36 v58.98,29.41 | v21.95,29.31 21.95,27.89 21.74,27.69 19.89,27.69 32U4.8
  Bottom 0.305: v58.98,29.41 22.05,29.41 v21.95,29.31
CS_RADIO  (via drill 0.3)
  Top 0.305: v44.55,15.19 v44.55,20.42 | v53.44,20.42 53.44,23.63 1284P.14 | RADIO.23 48.39,8.61 v48.16,8.84
  Bottom 0.305: v44.55,20.42 v53.44,20.42 | v48.16,8.84 48.16,11.58 v44.55,15.19
CS_SD  (via drill 0.3)
  Top 0.305: SD.2 16.37,14.12 v17.83,14.12 | 1284P.13 52.68,23.59 52.68,22.61 52.12,22.05 51.66,22.05 v50.85,22.86
  Bottom 0.305: v17.83,14.12 17.83,17.22 22.66,22.05 33.58,22.05 34.19,22.66 49.33,22.66 49.53,22.86 v50.85,22.86
D+
  Top 0.508: R8.1 11.28,30.23 10.59,30.91 8.04,30.91 USB1.D+
D-
  Top 0.508: R9.1 11.1,32.28 10.59,31.77 8.01,31.77 USB1.D-
GND  (via drill 0.3)
  Top 0.254: 52.83,10.41 52.83,10.21 arc-45 52.75,10.03 RADIO.PAD | 52.83,10.41 RADIO.12 | RADIO.18 arc-45 RADIO.18 51.23,11.1 arc-45 51.41,11.03 RADIO.PAD | RADIO.16 50.83,11.71 arc45 50.9,11.53 RADIO.PAD | RADIO.9 54.33,11.71 arc-45 54.25,11.53 RADIO.PAD | RADIO.6 53.43,10.61 arc45 53.25,10.53 RADIO.PAD | RADIO.10 53.83,9.86 RADIO.PAD | RADIO.3 53.33,9.11 RADIO.PAD | 54.33,8.11 RADIO.1 | RADIO.2 53.83,8.61 RADIO.PAD | 54.33,8.11 RADIO.32 | RADIO.PAD 54.33,8.11 | RADIO.21 52.33,9.61 RADIO.PAD | RADIO.31 53.83,9.41 53.33,9.91 | RADIO.27 51.83,9.11 RADIO.PAD | 53.33,9.91 RADIO.30 | 52.83,10.41 53.33,9.91 | 41.01,5.3 Q2.4 | 43.12,7 Q2.2
  Top 0.305: 32U4.43 22.46,37.83 C32.2 | C33.2 32U4.35 | 32U4.5 18.59,30.12 v18.57,30.1 18.47,30 | RADIO.1 55.34,8.11 v56.26,7.19 | BALUN.3 61.23,11.74 v61.21,11.76 | RADIO.27 51.82,7.34 51.82,6.35 51.36,5.89 46.48,5.89 46.23,5.64 46.23,4.93 45.41,4.12 40.34,4.12 39.75,4.7 C21.2 40.06,5.3 41.01,5.3 | Q2.2 43.52,7.3 C22.2 | 32U4.15 24.06,20.25 C31.2 | 1284P.6 48.44,29.44 48.31,29.57 47.09,29.57 | 47.09,29.57 46.77,29.57 C10.2 | Q4.2 43.77,28.75 46.94,28.75 47.13,28.94 47.13,29.53 47.09,29.57 | 13.74,73.08 13.72,73.1 C28.2
  Top 0.406: 32U4.23 32.83,25.32 C30.2
  Top 0.508: GPS.20 18.24,64.72 v18.26,64.75 | GPS.18 18.24,67.26 v18.26,67.28 | v27.64,71.17 28.99,71.17 GPS.21 | 13.74,73.08 15.75,71.07 GPS.22 16.62,71.09 v18.16,71.09 | C28.2 13.72,73.18 | C19.2 v61.21,3.25 | C20.2 v62.53,3.25 | C26.2 11.4,70.89 v11.38,70.92 | C13.2 v12.75,70.92
  other vias: 10.54,53.7 10.41,46.13 10.41,48.67 11.81,56.24 10.54,56.24 11.81,54.97 11.81,53.7 11.81,46.13 31.39,75.82 27.48,66.07 39.62,8.69 39.67,4.17 44.5,4.22 50.55,4.32 52.32,1.27 53.59,1.27 54.91,1.27 55.37,3.25 47.4,0.86 51.77,10.67 53.29,10.67 52.58,9.86 51.77,9.09 53.34,9.09 47.5,18.03 48.82,18.08 50.29,18.08 52.53,18.29 54.31,14.07 29.62,18.34 25.1,11.63 29.62,11.68 29.57,14.58 24.94,14.12 26.06,17.53 44.3,27.69 44.45,23.98 41.05,24.03 38.05,24.08 37.95,28.65 40.89,28.65 47.9,24.33 40.79,17.58 42.16,17.58 42.16,16.31 40.79,16.31 40.74,14.53 42.16,14.53 43.43,13.16 42.06,13.16 40.74,13.16 23.88,5.23 23.88,7.82 20.17,6.71 18.03,11.63 23.88,6.5 25.25,5.23 17.88,2.44 20.27,2.49 32.61,15.49 33.02,17.83 34.29,15.19 36.93,19.51 35.36,34.54 43.59,40.74 34.54,40.54 39.01,40.69 25.2,37.44 26.72,37.44 26.77,38.81 25.2,38.81 49.58,24.54 53.59,32.72 60.6,22.56 64.97,25.35 65.02,23.47 58.32,22.3 40.03,19.96 42.06,19.96 40.49,71.37 45.31,71.22 50.29,71.37 55.68,71.53 60.5,71.53 60.91,76.2 56.49,76.35 50.7,76.1 45.42,76.1 40.74,75.79 35.76,61.01 40.59,60.76 45.42,60.86 37.59,71.22 50.7,66.14 55.78,66.29 61.06,66.29 61.01,55.98 54.91,61.01 50.39,60.76 40.64,56.9 60.96,60.91 60.96,50.85 78.18,40.54 30.18,53.85 40.59,45.82 45.77,45.67 40.64,52.83 35.46,45.77 50.85,45.72 54.97,45.77 58.17,45.77 61.11,45.77 66.7,61.01 55.07,56.13 61.16,40.79 66.85,40.74 66.85,45.67 67.01,52.32 66.85,66.04 70.66,65.94 70.1,60.91 66.09,76.05 70.51,76 35.86,75.9 38.15,63.75 62.79,18.03 64.72,17.83 75.13,18.39 73.25,24.64 78.33,18.39 78.33,20.27 70.92,42.52 11.94,35.26 14.48,35.92 13.41,34.14 1.52,40.89 4.01,40.79 4.06,39.27 1.47,39.27 1.47,24.54 4.32,24.49 7.72,24.38 9.55,24.18 13.56,18.85 1.78,19.81 6.91,19.81 7.72,15.29 1.78,15.29 3.1,11.28 7.77,10.11 10.26,5.79 10.26,3 78.64,22.81 70.36,36.27 68.88,36.32 71.88,36.27 71.58,32.16 45.26,52.88 50.75,51.97 57.71,26.57 57.71,27.69 61.62,24.59 57.35,33.63 53.59,33.68 76,38.2 75.9,40.49 75.9,42.77 75.9,44.91 75.9,47.19 75.9,50.55 75.9,54.05 78.08,42.42 77.77,44.91 77.98,50.55 73.81,54.05 69.24,21.23
  pour Bottom (isolate 0.305): 9.78,33.02 9.78,57.81 15.11,57.81 15.11,43.21 15.09,41.5
  pour Top (no thermals): 9.3,46.84 9.3,55.42 9.78,55.42 9.78,57.81 15.14,57.81 15.14,53.52 9.53,53.52 9.53,48.79 13.36,48.79 13.36,45.26 9.78,45.26 9.78,46.84
  pour Top (no thermals): 46.79,9.14 38.86,9.14 38.81,3.96 45.21,3.96 46.79,5.23
  pour Top: 45.06,-0.41 45.06,2.9 48.11,2.9 50.09,4.83 51.92,4.83 53.04,5.94 53.04,7.21 53.19,7.37 54.81,7.37 55.73,6.45 55.73,-0.2 55.52,-0.41
  pour Bottom: 51.05,11.33 51.05,8.43 52.32,8.43 52.32,4.83 50.09,4.83 48.16,2.9 45.06,2.9 45.06,0.15 55.83,0.15 55.83,6.35 53.95,8.23 53.95,9.09 54.41,9.09 54.41,8.99 57.4,5.99 57.4,-0.46 81.33,-0.46 81.33,15.8 59.54,15.8 55.58,11.84 54.1,11.84 53.95,11.89 53.95,13.21 54.36,13.16 54.56,13.16 55.32,13.92 55.32,19.3 47.29,19.3 47.29,13.21 53.9,13.21 53.9,11.33
  pour Top: 47.19,13.11 47.19,19.25 55.27,19.25 55.27,13.36 54.36,12.45 47.75,12.45 47.29,12.9
  pour Top (no thermals): 24.79,21.49 30.02,21.49 30.02,11.02 24.59,11.02 24.59,21.29
  pour Bottom: -1.83,60.71 22.86,60.71 22.86,77.11 22.45,77.17 25.6,77.17 25.6,80.98 -1.68,80.98 -1.68,61.11
  pour Top (no thermals): 37.54,23.57 48.31,23.57 48.31,29.06 37.54,29.06
  pour Bottom: 29.97,11.07 29.97,21.44 24.59,21.44 24.59,11.07
  pour Bottom: 37.54,29.06 48.31,29.06 48.31,23.57 37.54,23.57
  pour Top: -2.49,58.72 4.37,58.72 4.37,42.98 16.61,42.98 16.61,58.98 24.18,58.98 24.18,81.03 30.33,81.03 30.33,45.92 34.34,45.92 34.34,52.83 30.48,52.83 30.48,81.03 81.13,81.03 81.13,17.48 59.49,17.48 55.07,13.06 50.39,13.06 49.38,13 49.17,30.28 36.12,30.28 36.12,22.4 49.17,22.4 49.17,10.31 37.64,10.31 37.64,2.59 42.16,2.59 42.16,-0.81 31.29,-0.81 31.29,22.56 23.22,22.56 23.22,9.35 31.14,9.35 31.14,-0.97 -2.49,-0.97
  pour Bottom: -2.49,58.72 4.37,58.72 4.37,42.98 16.61,42.98 16.61,58.98 24.18,58.98 24.18,81.03 30.33,81.03 30.33,45.92 34.34,45.92 34.34,52.83 30.48,52.83 30.48,81.03 81.13,81.03 81.13,17.48 59.49,17.48 55.07,13.06 50.39,13.06 49.38,13 49.17,30.28 36.12,30.28 36.12,22.4 49.17,22.4 49.17,10.31 37.64,10.31 37.64,2.59 42.16,2.59 42.16,-0.81 31.29,-0.81 31.29,22.56 23.22,22.56 23.22,9.35 31.14,9.35 31.14,-0.97 -2.49,-0.97
  pour Bottom: 38.91,9.09 38.91,4.01 45.11,4.01 46.74,5.28 46.74,9.09
GPS_1PPS  (via drill 0.3)
  Top 0.305: GPS.3 29.92,67.26 30.18,67 30.18,66.14 v30.79,65.53 | v56.29,42.77 v56.29,64.92
  Top 0.406: v58.27,38.71 58.27,35.28 1284P.36
  Bottom 0.305: v30.79,65.53 46.94,65.53 47.4,65.08 56.13,65.08 v56.29,64.92 | 56.29,40.69 v56.29,42.77
  Bottom 0.406: v58.27,38.71 56.29,40.69
GPS_ON_OFF  (via drill 0.3)
  Top 0.406: v46.43,53.54 v46.43,58.98 | 1284P.43 v52.63,52.78 | v52.63,52.78
  Top 0.508: Q7.1 28.42,60.39 R22.2 28.5,60.47 v28.5,58.88
  Bottom 0.406: v28.5,58.88 46.33,58.88 v46.43,58.98 | v46.43,53.54 51.87,53.54 v52.63,52.78
GPS_RFIN
  Top 0.762: C13.1 12.75,66 L2.1 12.74,65.99 GPS.19
HUM_SENSE  (via drill 0.3)
  Top 0.305: v63.04,32.61 61.65,32.61 1284P.32 | R7.2 67.36,29.22 v67.36,32.61 | HUM1.2 70.38,32.59 v70.36,32.61
  Bottom 0.305: v63.04,32.61 v67.36,32.61 v70.36,32.61
HV_SENSE
  Top 0.305: HVPS-ALLAN.4 66.98,71.04 65.23,69.29 65.23,39.83 62.23,36.83 62.23,34.04 1284P.33
HVPS_EN  (via drill 0.3)
  Top 0.305: 1284P.34 59.83,35.8 59.84,35.81 | Q5.1 33.9,56.12 R21.1 33.9,62.04 37.44,65.58 37.44,68.38 v37.29,68.53
  Top 0.406: Q5.1 35.09,56.09 v35.1,56.08 | 59.84,35.81 59.84,50.14 v59.79,50.19
  Bottom 0.305: v37.29,68.53 32.23,68.53 HVPS-ALLAN.6
  Bottom 0.406: v35.1,56.08 35.1,51.41 36.32,50.19 v59.79,50.19 59.89,50.19
MISO  (via drill 0.3)
  Top 0.305: R15.2 33.1,5.06 v33.12,5.08 | v35.41,26.67 35.41,31.45 38.2,34.24 v38.61,34.24 | v31.6,13.01 31.5,13.11 31.5,22.71 v31.39,22.71 | 32U4.11 19.89,25.35 v21.64,25.35 | v48.72,33.27 49.35,32.64 1284P.2
  Bottom 0.305: v33.12,5.08 32.46,5.08 31.8,5.74 31.8,7.92 ISP1.1 33.1,11.5 v31.6,13.01 | v35.41,26.67 35.36,24.69 33.38,22.71 v31.39,22.71 24.74,22.71 22.1,25.35 v21.64,25.35 | v38.61,34.24 47.09,34.24 48.01,33.33 48.67,33.33 v48.72,33.27
MISO_P  (via drill 0.3)
  Top 0.305: SD.7 14.99,19.61 v14.94,19.66 | v33.12,1.17 33.12,2.05 R15.1 | RADIO.20 48.72,10.11 48.16,10.67 45.62,10.67 v45.57,10.72 | v35.97,0.96 v35.97,9.7
  Bottom 0.305: v14.94,19.66 14.94,3.81 15.65,3.1 15.65,3.15 18.44,0.51 32.21,0.51 32.92,1.17 v33.12,1.17 33.17,0.96 v35.97,0.96 | v45.57,10.72 45.26,10.41 36.27,10.41 35.97,10.11 v35.97,9.7
MOSI  (via drill 0.3)
  Top 0.305: ISP1.4 30.56,6.36 R12.2 | v34.7,27.13 34.7,31.85 37.8,34.95 v37.95,34.95 | v30.73,23.32 30.73,11.99 v30.84,11.89 | 32U4.10 19.92,26.06 v22.45,26.06 | v48.46,34.24 49.23,34.24 1284P.1
  Bottom 0.305: v34.7,27.13 34.7,24.94 33.12,23.37 30.79,23.37 v30.73,23.32 25.2,23.32 v22.45,26.06 | v30.84,11.89 30.84,11.48 29.31,9.96 29.31,7.93 ISP1.4 | 48.41,34.29 v48.46,34.24 47.75,34.95 v37.95,34.95
MOSI_P  (via drill 0.3)
  Top 0.305: SD.3 13.63,15.21 v13.61,15.19 | v34.54,10.67 34.54,0.56 34.34,0.51 28.19,0.51 27.99,0.56 | 27.99,0.56 R12.1 | v16.41,0.56 27.99,0.56 | RADIO.22 48.76,9.11 47.8,10.06 44.91,10.06 v43.23,11.73
  Bottom 0.305: v34.54,10.67 35.61,11.73 v43.23,11.73 | v13.61,15.19 13.61,3.35 v16.41,0.56
N$1
  Top 0.305: 32U4.16 24.86,21.88 26.11,20.63 Q3.3 26.16,19.82 26.16,18.69 27.38,17.48 27.38,12.9 26.66,12.18 C23.1
N$2  (via drill 0.3)
  Top 0.305: LED1.C v19.81,43.64
  Top 0.406: R1.2 15.24,51.14 15.24,49.12 17.17,47.19 17.17,45.21 17.83,44.55 18.49,44.55 18.84,44.21 LED1.C
  Bottom 0.305: v19.81,43.64 LED1.C LED1_BK.C
N$3
  Top 0.406: R18.2 75.08,64.18 PULSE1.1
N$4
  Top 0.305: CHARGE1.5 10.4,50.1 R5.1
N$5
  Top 0.305: BALUN.4 C4.2
  pour Top (no thermals): 60.43,10.36 58.83,10.31 58.83,10.92 59.33,10.92 60.63,10.36
N$6
  Top 0.305: 1284P.8 48.16,27.84 48.01,27.69 48.01,26.87 47.4,26.26 45.52,26.26 44.37,25.11 Q4.3 42.34,25.3 C12.1
N$7
  Top 0.305: C34.1 41.47,26.31 44.25,26.31 45.45,27.51 Q4.1 47.65,28.64 1284P.7
N$8
  Top 0.305: C16.1 50.8,15.33 50.8,14.73 51.83,13.7 RADIO.14 RADIO.13
N$9
  Top 0.305: RADIO.29 52.83,5.88 C15.1
N$11
  Top 0.508: ANT_GPS.1 5.54,70.1 5.68,70.25 arc-45 7.42,70.97 F2.2
  Top 0.762: C26.1 11.4,65.97 L2.2
  Top 1.27: ANT_GPS.1 5.59,65.96 L2.2
N$12
  Top 0.254: C21.1 39.76,6.99
  Top 0.305: 39.76,6.99 40.31,7.55 Q2.3 41.67,8.14 42.11,8.59 45.67,8.59 46.94,7.32 50.79,7.32 RADIO.25
N$13
  Top 0.305: RADIO.26 51.36,7.32 51.36,6.81 51,6.45 46.13,6.45 45.28,5.6 C22.1 43.52,5.6 Q2.1
N$14
  Top 0.508: GPS.17 15.29,68.53 14.81,69.01 14.81,70.51 13.23,72.08 9.3,72.08 9.3,71.11 arc-45 F2.1
N$15
  Top 1.778: Q5.3 34.55,53.89 35.87,52.58 IROVER.3
N$16  (via drill 0.3)
  Top 0.305: LED3_BK.A 19.79,41.07 v19.81,41.1 20.39,41.1 R6.2
  Bottom 0.305: LED3_BK.A 18.84,41.1 v19.81,41.1
N$17
  Top 0.305: RADIO.7 55.61,11.11 56.19,11.68 56.17,11.7 R4.2 TP1.TP
N$18
  Top 0.305: BALUN.6 C3.2
  pour Top (no thermals): 60.43,9.35 58.83,9.4 58.83,8.79 59.33,8.79 60.63,9.35
N$19
  Top 0.254: RADIO.5 56.75,10.11 C4.1
  pour Top (no thermals): 55.47,10.11 57.48,10.11 57.48,10.95 56.92,10.95
N$20
  Top 0.254: RADIO.4 56.75,9.61 C3.1
  pour Top (no thermals): 55.47,9.6 57.48,9.6 57.48,8.76 56.95,8.76
N$21
  Top 0.381: L1.1 61.22,9.35 BALUN.1
  Top 0.508: L1.1 61.22,6.1 C19.1
N$22
  Top 0.762: Q7.3 24.12,73.67 21.64,76.15 GPS.12 16.33,76.14 C28.1
N$24
  Top 0.305: 32U4.17 25.66,22.5 27.23,20.93 27.23,18.95 28.5,17.68 Q3.1 28.5,13.99 C24.1
N$25  (via drill 0.3)
  Top 0.305: LED2.A 18.84,42.32 v19.76,42.32 21.2,42.32 R17.2
  Bottom 0.305: LED2_BK.A v19.76,42.32
N$27
  Top 0.406: 32U4.3 18.27,31.72 17.7,32.28 R9.2
N$28
  Top 0.406: 32U4.4 18.35,30.92 17.63,30.2 15.57,30.2 R8.2
N$32
  Top 0.254: 32U4.33 32.13,33.99 SJ2.1
RADIO_IRQ  (via drill 0.3)
  Top 0.305: 1284P.25 62.73,27.04 63.25,26.52 v63.25,24.28 | v61.77,22.45 61.77,19.1 61.42,18.75 v56.59,18.75 | v43.64,19.66 43.64,15.14 v44.65,14.12 | RADIO.24 47.57,8.11 v47.45,8.23
  Bottom 0.305: v63.25,24.28 63.25,23.93 v61.77,22.45 | v47.45,8.23 47.45,11.33 v44.65,14.12 | v56.59,18.75 55.68,19.66 v43.64,19.66
RADIO_RF
  Top 0.508: L1.2 C20.1
  Top 1.27: ANT_RADIO.1 64.3,9.75 arc90 L1.2
RADIO_SLEEP  (via drill 0.3)
  Top 0.305: RADIO.11 53.34,14.07 52.58,14.83 R3.1 51.75,15.05 51.21,15.6 51.21,21.13 49.94,22.4 49.94,23.77 v50.55,24.38 | v53.85,25.35 54.91,26.42 v54.91,32.77 | v59.03,32.77 1284P.35
  Bottom 0.305: v50.55,24.38 52.88,24.38 v53.85,25.35 | v54.91,32.77 v59.03,32.77
RESET  (via drill 0.3)
  Top 0.305: 1284P.4 48.72,31.04 47.19,32.56 47.19,35.61 v47.95,35.61 | GPS.8 27.18,74.88 v26.06,73.76 | v19,39.32 18.03,39.32 v16.61,37.9 | v21.39,47.35 21.39,51.87 v21.34,51.92 | RADIO.8 55.08,12.46 v55.22,12.6 | v73,28.14 73,34.39 v72.44,34.95
  Top 0.508: v19.71,21.84 21.84,21.84 22.46,22.46 32U4.13 | v16.71,9.14 13.06,9.14 12.34,9.86 12.34,20.52 v13.11,21.29 | R2.1 41.38,35.83 v41.35,35.87 | v18.75,36.63 17.88,36.63 v16.61,37.9 16.57,37.85 RESET_BUTTON.B
  Bottom 0.305: v26.06,73.76 26.06,54 23.98,51.92 v21.34,51.92 | v19,39.32 21.39,41.71 v21.39,47.35 | v55.22,12.6 61.92,19.3 64.92,19.3 73,27.38 v73,28.14 | 61.01,35.61 61.67,34.95 v72.44,34.95
  Bottom 0.508: v16.61,37.9 16.61,27.89 19.76,24.74 19.76,21.89 v19.71,21.84 19.15,21.29 v13.11,21.29 | ISP1.5 16.79,9.22 v16.71,9.14 | v18.75,36.63 19.51,35.87 v41.35,35.87 41.6,35.61 v47.95,35.61 61.01,35.61
RX0  (via drill 0.3)
  Top 0.406: 32U4.21 28.86,30.38 v28.91,30.43 | v53.24,30.28 53.24,27.33 52.95,27.04 1284P.9
  Bottom 0.406: v28.91,30.43 53.09,30.43 v53.24,30.28 75.89,30.28 SERIAL1.3
RX1  (via drill 0.3)
  Top 0.305: 1284P.11 50.07,25.4 v51.51,25.4 | v51.56,27.84 v51.56,33.43 | v50.14,34.24 48.77,35.61 v48.77,40.49 | GPS.4 30.27,68.53 30.89,67.92 v30.89,66.7 | v48.01,44.81 v48.01,65.99
  Bottom 0.305: v51.51,25.4 51.56,25.45 v51.56,27.84 | v51.56,33.43 50.75,34.24 v50.14,34.24 | v48.77,40.49 48.77,44.04 v48.01,44.81 | v30.89,66.7 31.45,66.14 47.85,66.14 v48.01,65.99
SCK
  Top 0.305: S1.2 S1.1 30.56,10.16 ISP1.3 31.8,7.98 31.8,5.89 30.59,4.68 R13.2
SCK_32U4  (via drill 0.3)
  Top 0.305: S1.4 32.41,22.23 32.41,23.47 v31.8,24.08 | v21.74,26.92 32U4.9
  Bottom 0.305: v21.74,26.92 29.82,26.92 30.38,26.36 30.38,24.64 30.94,24.08 v31.8,24.08
SCK_1284P  (via drill 0.3)
  Top 0.305: 50.02,31.85 1284P.3 49.03,31.84 v48.36,32.51 | S1.3 35.76,22.96 36.07,23.27 36.07,30.99 38.61,33.53 v39.17,33.53
  Bottom 0.305: v39.17,33.53 46.58,33.53 47.6,32.51 v48.36,32.51
SCK_P  (via drill 0.3)
  Top 0.305: SD.5 14.35,17.41 v14.33,17.42 | 30.63,2.05 R13.1 v30.58,1.12 31.39,1.12 31.85,1.57 v31.85,3.25 | v35.26,3.25 v35.26,10.21 | v16.1,1.83 16.76,1.17 v23.27,1.17 | RADIO.19 49.09,10.61 48.26,11.43 v45.06,11.43
  Bottom 0.305: v14.33,17.42 14.33,3.61 v16.1,1.83 | v35.26,10.21 36.02,10.97 43.74,10.97 44.2,11.43 v45.06,11.43 | v23.27,1.17 30.53,1.17 v30.58,1.12 | v31.85,3.25 v35.26,3.25
SD_PWR  (via drill 0.3)
  Top 0.305: 19.75,14.13 19.75,14.04 Q1.1 | v54.2,22.25 54.2,23.61 1284P.15
  Top 0.508: R16.1 19.75,13.99 Q1.1 18.69,15.04 v18.69,15.19
  Bottom 0.305: v18.69,15.19 18.69,17.22 22.86,21.39 37.44,21.39 38.1,22.05 54,22.05 v54.2,22.25
SENSE
  Top 0.508: TEMP1.1 71.6,23.78 Q6.3 71.68,26.92 HUM1.3
SENSE_PWR
  Top 0.508: 1284P.22 62.21,23.64 66.24,19.61 70.85,19.61 | 70.85,19.61 R19.1 | 70.85,19.61 70.85,21.53 Q6.1
STAT_LED
  Top 0.406: 1284P.44 51.83,38.7 48.18,42.34 R17.1
SWITCH  (via drill 0.3)
  Top 0.305: JP8.2 15,2.37 R14.2 19.44,4.79 v20.27,3.96 | v39.78,18.34 39.78,12.5 37.69,10.41 v37.69,4.78 | v59.49,19.91 v59.49,22.25 | v55.88,25.7 55.93,25.7 55.93,33.02 55.03,33.92 1284P.40
  Bottom 0.305: v20.27,3.96 37.34,3.96 37.69,4.32 v37.69,4.78 | v39.78,18.34 40.34,18.9 55.17,18.9 56.29,17.78 58.47,17.78 59.49,18.8 v59.49,19.91 | v59.49,22.25 59.49,25.15 58.93,25.7 v55.88,25.7
TEMP_SENSE  (via drill 0.3)
  Top 0.305: TEMP1.2 66.87,25.21 68.22,26.57 68.22,31.8 v68.28,31.85 | v62.99,31.8 61.67,31.8 1284P.31
  Bottom 0.305: v68.28,31.85 63.04,31.85 v62.99,31.8
TX0  (via drill 0.3)
  Top 0.305: 50.05,26.26 1284P.10
  Top 0.406: 32U4.20 28.06,31.11 v28.09,31.14 | v54.1,31.09 54.1,27.03 53.34,26.26 50.05,26.26
  Bottom 0.406: v28.09,31.14 54.05,31.14 v54.1,31.09 76.4,31.09 SERIAL1.2
TX1  (via drill 0.3)
  Top 0.305: 1284P.12 51.83,24.7 v52.32,25.2 | v52.32,27.99 v52.32,33.58 | v50.75,34.9 49.48,36.17 v49.48,39.93 | GPS.5 30.33,69.8 v30.38,69.85 | v48.92,66.9 48.92,45.31 v49.48,44.76
  Bottom 0.305: v52.32,25.2 v52.32,27.99 | v52.32,33.58 51,34.9 v50.75,34.9 | v49.48,39.93 v49.48,44.76 49.48,44.91 | v30.38,69.85 30.38,68.38 31.8,66.95 48.87,66.95 v48.92,66.9
VBATT  (via drill 0.3)
  Top 0.508: 5.82,55.3 5.82,55.4 6.4,55.4 v6.35,54.97 | BATT1.1 3.2,49.94 5.89,52.63 | GPS.11 22.55,77.42 v24.28,75.69 | v31.65,40.89 35,37.54 v35,36.98 | v65.84,37.69 v65.85,37.68 R10.2 | v20.02,48.62 18.62,48.62 REG1.1 | v18.14,59.69 15.8,59.69 15.34,59.23
  Top 0.762: BATT2.1 5.82,55.3 | C2.1 8.38,54.98
  Top 1.27: C5.1 18.28,48.27 REG1.1
  Top 1.778: 18.28,48.27 16.66,49.88 16.66,58.37 15.8,59.23 15.34,59.23 8.79,59.23 7.01,57.45 7.01,56.84 v7.62,56.24
  Bottom 0.508: v24.28,75.69 24.28,59.79 18.24,59.79 v18.14,59.69 | v31.65,40.89 29.67,40.89 24.94,45.57 24.94,47.65 23.98,48.62 v20.02,48.62 | v35,36.98 35.1,36.88 62.69,36.88 63.5,37.69 v65.84,37.69
  other vias: 7.62,54.97 7.62,53.7 6.35,53.7 6.35,56.24
  pour Bottom: 8.56,52.12 8.64,57.78 5.49,57.78 5.49,52.04 8.64,52.02
  pour Top (no thermals): 8.59,52.04 8.59,57.86 5.51,57.86 5.51,52.07 8.43,52.07
VBUS  (via drill 0.3, 0.51)
  Top 0.305: C1.1 8.51,44.48 14.58,44.48 16.23,43.64 LED1.A 17.34,43.73 v16.56,44.5 | 8.64,32.77 8.2,32.77 USB1.VBUS
  Top 0.508: 32U4.7 19.84,28.5 18.39,28.5 15.63,25.74 C27.1 16.46,24.74 v16.92,24.28
  Top 0.762: 8.64,32.77 9.8,33.93 v10.21,33.93 10.21,42.57 7.57,45.21 7.57,46.08 v7.62,46.13
  Bottom 0.305: LED1_BK.A 16.56,44.36 v16.56,44.5
  Bottom 0.508: v16.92,24.28 11.33,24.28 10.72,24.89 10.72,33.43 v10.21,33.93
  Bottom 0.762: v7.62,46.13 7.82,45.92
  other vias: 6.35,47.4 6.35,48.67 7.62,48.67 7.62,47.4 6.35,46.13
  pour Bottom: 8.71,50.39 8.66,44.53 5.69,44.53 5.69,50.44 8.48,50.42
  pour Top (no thermals): 8.64,50.42 8.64,44.5 5.69,44.5 5.69,50.42
VCC3  (via drill 0.3, 0.36)
  Top 0.305: 32U4.24 | C33.1 30.57,37.45 29.67,36.55 32U4.34 | 32U4.14 | C18.1 50.34,14.28 51.31,13.31 51.31,12.38 RADIO.15 | 1284P.17 55.83,24.79 56.64,25.6 v56.64,28.65 | v63.04,28.09 62.5,28.64 1284P.27
  Top 0.406: 32U4.6 17.99,29.32 16.74,28.07 C25.1
  Top 0.508: C25.1 15.58,26.89 v14.96,26.26 12.98,26.26 TP2.TP | 32U4.44 20.74,36.04 C32.1 | C11.1 55.83,21.58 1284P.17 | 21.6,11.53 R16.2 | C9.1 1284P.38 | C30.1 31.48,26.1 32U4.24 | C31.1 23.26,20.37 32U4.14 | R22.1 28.42,62.29 | 1284P.5 47.8,30.24 C10.1 | R2.2 44.66,39.06 v46.33,39.06 | HVPS-ALLAN.5 32.38,71.04
  Top 0.762: v15.04,34.42 15.06,34.39 18.03,34.39 20.74,37.1 C32.1 20.69,37.9 v18.95,37.9 | Q1.2 21.6,11.53 21.6,7.72 | C31.1 19.41,19.86 18.54,20.73 18.54,24.26 v18.29,24.51 | 30.57,39.48 v30.53,39.52 31.57,38.48 | 31.57,38.48 33.78,36.27 33.78,33.98 33.76,33.96 C30.1 33.79,26.06 | C9.1 56.63,39.05 v56.64,39.06 56.67,39.09 | F1.1 37.9,1.98 v37.26,2.62 36.85,3.02 v36.85,6.6 36.85,11.05 38.66,12.85 v38.66,21.29 36.78,23.16 36.78,29.41 v40.08,32.72 | v45.87,21.29 45.92,21.23 45.92,13.36 46.33,12.95 49.73,12.95 49.73,14.24 C18.1 | R3.2 55.51,19.68 C11.1 55.52,21.25 55.52,19.81 v58.12,19.81 | C10.1 47.51,31.08 46.38,32.21 v46.38,32.61 46.38,39.01 v46.33,39.06 | C33.1 31.2,38.48 31.57,38.48 | 21.6,7.72 21.6,2.63 v21.79,2.29 | JP8.1 13.79,5.87 15.8,7.87 21.45,7.87 21.6,7.72 | v24.64,43.59 23.56,44.67 C6.1 | R22.1 32.16,62.19 32.2,62.23 | 28.42,62.29 Q7.2 | v63.5,20.68 66.04,18.14 71.93,18.14 72.54,18.75 72.54,19.55 R19.2 72.63,19.63 Q6.2 74.08,21.66 74.78,22.35 74.78,33.68 75.34,34.24 SERIAL1.1
  Top 1.27: C6.1 23.56,48.19 REG1.3
  Top 1.778: REG1.3 26.09,48.59 27.74,50.24 27.74,51.58 C37.+ 27.84,54.56 29.36,56.08 Q5.2 32.02,57.86 R21.2 32.2,62.23 32.2,63.08 35.2,66.09 35.2,70.16 34.29,71.07 32.23,71.07 HVPS-ALLAN.5
  Bottom 0.305: v56.64,28.65 62.48,28.65 v63.04,28.09 | ISP1.2 33.17,6.6 33.38,6.6 | 54.15,21.29 54.2,21.23
  Bottom 0.762: v15.04,34.42 15.04,26.34 v14.96,26.26 16.54,26.26 v18.29,24.51 | v18.95,37.9 v24.64,43.59 25.04,43.59 29.11,39.52 v30.53,39.52 30.99,39.06 v46.33,39.06 v56.64,39.06 | 54.15,21.29 v45.87,21.29 v38.66,21.29 | 54.2,21.23 58.06,21.23 | v58.12,19.81 58.12,21.18 58.06,21.23 | 33.1,6.55 33.15,6.6 33.38,6.6 v36.85,6.6 | v21.79,2.29 37.08,2.29 v37.26,2.62 | v40.08,32.72 40.18,32.61 v46.38,32.61 | 58.06,21.23 62.94,21.23 v63.5,20.68
VDD
  Top 0.508: 18.85,16.3 C35.1 18.85,16.24
  Top 0.762: SD.4 18.85,16.3 | 18.85,16.24 Q1.3

### Text on the board
tPlace: by FakuFaku | November 2013 | 32u4 | 1284P | Safecast | bGeigie v3.6
bPlace: OSHW | Designed for Safecast | at Tokyo Hackerspace | by Robin Scheibler | Charging | Status | USB | License CC-BY-SA 3.0 | https://github.com/Safecast/bGeigie2 | Thanks to Akiba from Freaklabs | and everybody at Safecast | and the Tokyo Hackerspace.
tNames: ANTENNA_GPS | LED1 | LED2 | LED3 | RESET | 3.3V | TX | RX | GND | RADIO | ANTENNA_RADIO | Q2
bNames: LED1_BK | LED2_BK | LED3_BK